# Altium schematic sheet Fraduino.SchDoc
size A4; SheetNumber: 1; SheetTotal: 1
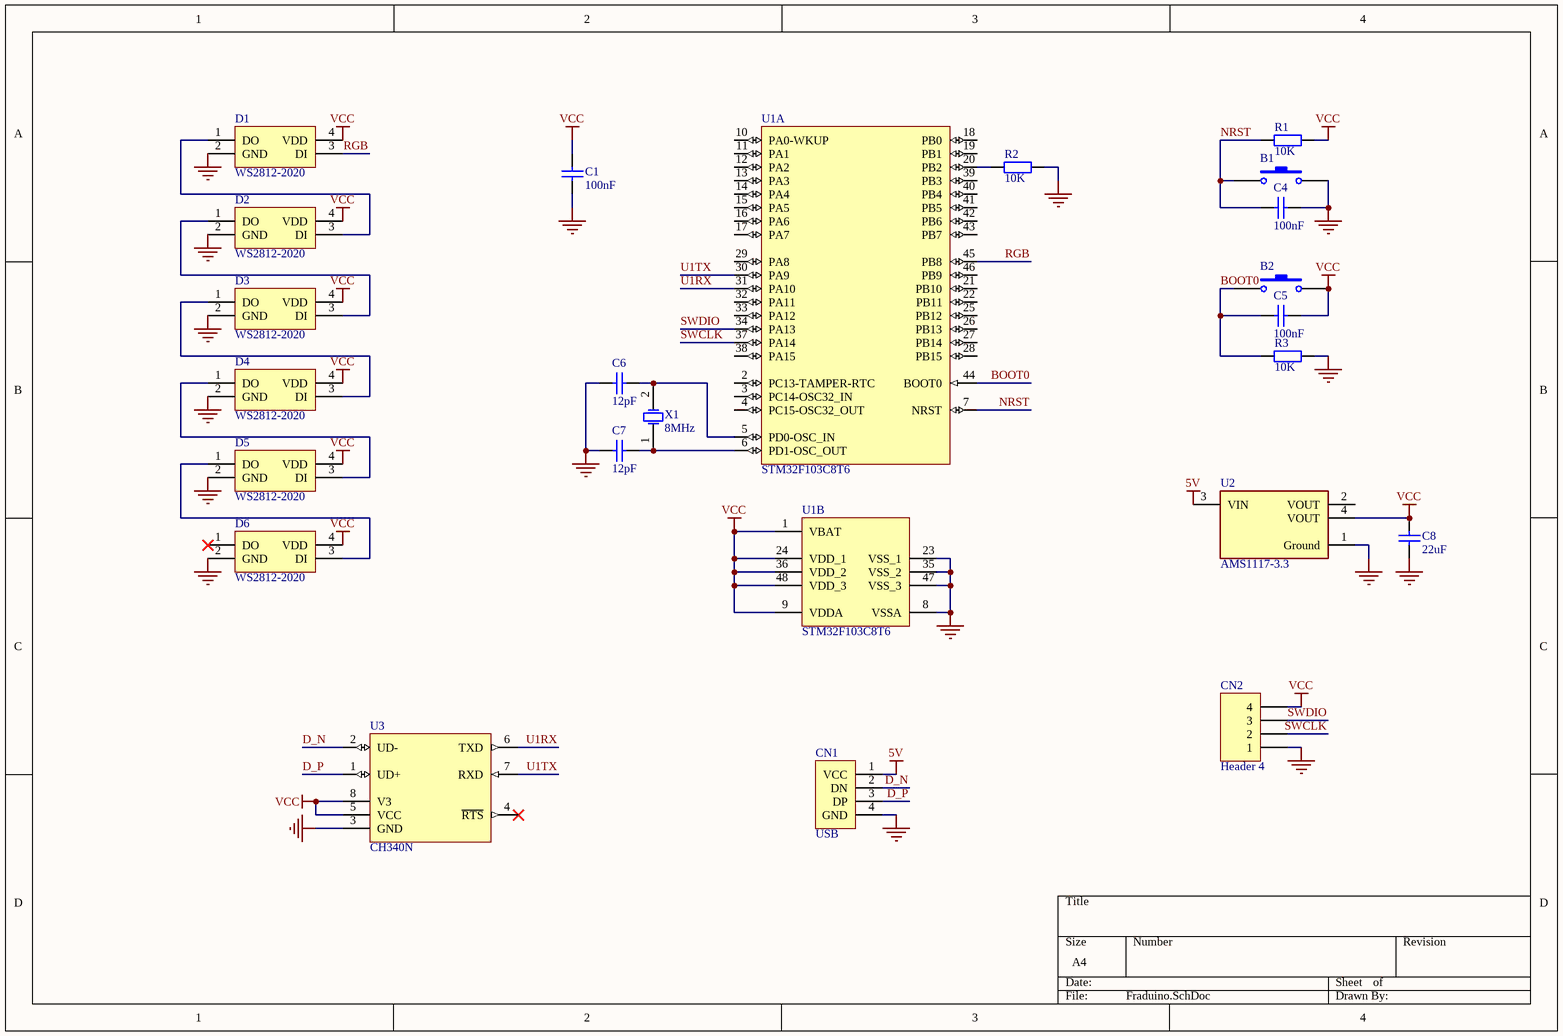
[diagram p0: Fraduino.SchDoc]

## Parts
B1  SW-PB  [TSW SMD-3*4*2.5]  (value not drawn)
B2  SW-PB  [TSW SMD-3*4*2.5]  (value not drawn)
C1  value 100nF  [C0603]  (hidden comment: Cap)
C4  value 100nF  [C0603]  (hidden comment: Cap)
C5  value 100nF  [C0603]  (hidden comment: Cap)
C6  value 12pF  [C0603]  (hidden comment: Cap)
C7  value 12pF  [C0603]  (hidden comment: Cap)
C8  value 22uF  [C0603]  (hidden comment: Cap)
CN1  USB  [USB_SMD]
CN2  Header 4  [TESTPAD4]
D1  WS2812-2020  [WS2812-2020-S]
D2  WS2812-2020  [WS2812-2020-S]
D3  WS2812-2020  [WS2812-2020-S]
D4  WS2812-2020  [WS2812-2020-S]
D5  WS2812-2020  [WS2812-2020-S]
D6  WS2812-2020  [WS2812-2020-S]
R1  value 10K  [R0603]  (hidden comment: Res2)
R2  value 10K  [R0603]  (hidden comment: Res2)
R3  value 10K  [R0603]  (hidden comment: Res2)
U1  STM32F103C8T6  [STM-LQFP48_L]  (parts A,B of 2)
U2  AMS1117-3.3  [FP-AMS1117-IPC_C]
U3  CH340N  [SOP8_L]
X1  8MHz  [ABRA-ABM3-2_V]

## Nets
5V: CN1.1(VCC) U2.3(VIN)
GND: B1.2 C1.1 C4.1 C6.2 C7.2 C8.2 CN1.4(GND) CN2.1 D1.2(GND) D2.2(GND) D3.2(GND) D4.2(GND) D5.2(GND) D6.2(GND) R2.1 R3.1 U1.8(VSSA) U1.23(VSS_1) U1.35(VSS_2) U1.47(VSS_3) U2.1(Ground) U3.3(GND)
VCC: B2.2 C1.2 C5.1 C8.1 CN2.4 D1.4(VDD) D2.4(VDD) D3.4(VDD) D4.4(VDD) D5.4(VDD) D6.4(VDD) R1.1 U1.1(VBAT) U1.9(VDDA) U1.24(VDD_1) U1.36(VDD_2) U1.48(VDD_3) U2.4(VOUT) U3.5(VCC) U3.8(V3)
BOOT0: B2.1 C5.2 R3.2 U1.44(BOOT0)
D_N: CN1.2(DN) U3.2(UD-)
D_P: CN1.3(DP) U3.1(UD+)
NRST: B1.1 C4.2 R1.2 U1.7(NRST)
RGB: D1.3(DI) U1.45(PB8)
SWCLK: CN2.2 U1.37(PA14)
SWDIO: CN2.3 U1.34(PA13)
U1RX: U1.31(PA10) U3.6(TXD)
U1TX: U1.30(PA9) U3.7(RXD)
NetC6_1: C6.1 U1.5(PD0-OSC_IN) X1.2(X2)
NetC7_1: C7.1 U1.6(PD1-OSC_OUT) X1.1(X1)
NetD1_1: D1.1(DO) D2.3(DI)
NetD2_1: D2.1(DO) D3.3(DI)
NetD3_1: D3.1(DO) D4.3(DI)
NetD4_1: D4.1(DO) D5.3(DI)
NetD5_1: D5.1(DO) D6.3(DI)
NetR2_2: R2.2 U1.20(PB2)

Not connected (* = marked no-connect by the designer): D6 1(DO)*; U1 2(PC13-TAMPER-RTC) 3(PC14-OSC32_IN) 4(PC15-OSC32_OUT) 10(PA0-WKUP) 11(PA1) 12(PA2) 13(PA3) 14(PA4) 15(PA5) 16(PA6) 17(PA7) 18(PB0) 19(PB1) 21(PB10) 22(PB11) 25(PB12) 26(PB13) 27(PB14) 28(PB15) 29(PA8) 32(PA11) 33(PA12) 38(PA15) 39(PB3) 40(PB4) 41(PB5) 42(PB6) 43(PB7) 46(PB9); U2 2(VOUT); U3 4(~{RTS})*

## Library data of the parts
B1 B2 = SW-PB: Switch; Published: 24-Mar-1999; LatestRevisionDate: 17-Jul-2002; LatestRevisionNote: Re-released for DXP Platform.; PackageReference: SPST-2; Publisher: Altium Limited; PackageDescription: Switch; 2 Leads
C1 C4-C8 = Cap: Capacitor; Published: 8-Jun-2000; LatestRevisionDate: 17-Jul-2002; LatestRevisionNote: Re-released for DXP Platform.; PackageReference: RAD-0.3; Publisher: Altium Limited; PackageDescription: Radial Cap, Thru-Hole; 2 Leads; 0.3 in Pin Spacing
CN1 = USB-SMD: USB公头
CN2 = Header 4: Header, 4-Pin; LatestRevisionDate: 17-Jul-2002; LatestRevisionNote: Re-released for DXP Platform.; Publisher: Altium Limited
D1-D6 = WS2812-2020: RGB LED
R1-R3 = Res2: Resistor; Published: 8-Jun-2000; LatestRevisionDate: 17-Jul-2002; LatestRevisionNote: Re-released for DXP Platform.; PackageReference: AXIAL-0.4; Publisher: Altium Limited; PackageDescription: Axial Device, Thru-Hole; 2 Leads; 0.4 in Pin Spacing
U1 = CMP-0237-00215-3: ARM Cortex-M3 32-bit MCU, 64 KB Flash, 20 KB Internal RAM, 37 I/Os, 48-pin LQFP, -40 to 85 degC, Tray; Supply Voltage(Vcc) min (V): 2; Internal RAM Size (kB): 20; FLASH Size (Prog) (kB): 64; A/D Converter: 2x12-bit (10 Channel); I/Os (High Current): 37; Operating Frequency(F) (Processor speed) (MHz): 72; Core: ARM Cortex-M3; ComponentLink3Description: Package Specification; Mounting Technology: Surface Mount; PartNumber: STM32F103C8T6; PackageReference: LQFP48; Packing: Tray; ComponentLink3URL: http://www.st.com/st-web-ui/static/active/en/resource/technical/document/datasheet/DM00058181.pdf; DatasheetVersion: Rev. 16; ComponentLink1URL: http://www.st.com/web/en/home.html; PackageVersion: Rev. 6, 06/2013; ComponentLink2URL: http://www.st.com/st-web-ui/static/active/en/resource/technical/document/datasheet/CD00161566.pdf; ComponentLink1Description: Manufacturer URL; ComponentLink2Description: Datasheet; PackageDescription: 48-Pin Low Profile Quad Flat Package, 7 x 7 mm Body, 0.5 mm Pitch
U2 = CMP-209535-000001-1: LDO Voltage Regulators 1A, 3.3V; Manufacturer: Advanced Monolithic Systems; Dropout Voltage: 1.1V; Output Type: Fixed; Nominal Supply Current: 5mA; Max Power Dissipation: 1.2W; Max Supply Voltage: 15V; Number Of Outputs: 1; Standoff Height: 0.64mm; Max Junction Temp: +125°C; Height: 1.8mm; Package: AMS1117; Device Class L2: Power Management ICs; ComponentLink2Description: Datasheet; ComponentLink2URL: http://www.advanced-monolithic.com/pdf/ds1117.pdf; Category: IC; RoHS: TRUE; Automotive: No; Device Class L1: Integrated Circuits (ICs); Output Current: 1A; Device Class L3: Voltage Regulators - Linear; Temperature: -40°C to +125°C; Output Voltage: 3.3V; Manufacturer Part Number: AMS1117-3.3; Temperature Range Low: -40°C; Octopart: https://octopart.com/ams1117-3.3-advanced+monolithic+systems-25899300; Lead Free: Yes; Ipc Land Pattern Name: SOT229P700X180-4; Temperature Range High: +125°C
U3 = CH340N: 串口转USB
X1 = CMP-2000-05033-1: Miniature Ceramic Crystal, 8 MHz, -40 to 85 degC, 2-Pin SMD, RoHS, Tape and Reel; Manufacturer: ABRACON; Case Length: 5mm; Case Width: 3.2mm; Case Height: 1.3mm; Load Capacitance: 18pF; Frequency Stability: 30PPM; ESR: 140Ohms; Tolerance: 20PPM; Type: MiniatureCeramicCrystal; Factory Pack Quantity: 1000; Package / Case: 5mmx3.2mm; Mounting Style: SMD/SMT; Manufacturer URL: http://www.abracon.com/; RoHS: Details; Frequency: 8MHz; Dimensions: 3.2mmWx5mmLx1.3mmH; Datasheet URL: http://www.farnell.com/datasheets/1754353.pdf; Brand: ABRACON; Packaging: Reel; Product Category: Crystals; Package Description: 2-Pin Surface Mount Device, Body 5 x 3.2 mm; Package URL: http://www.abracon.com/Support/PackageDrawing/Resonators/ABM3.PDF; Operating Temperature Range: -40Cto+85C; Termination Style: SMD/SMT; Datasheet Version: Sep-13; Series: ABM3; Package Reference: ABM3-2